# EAGLE design tinyusbboard (EAGLE 7.4.0)
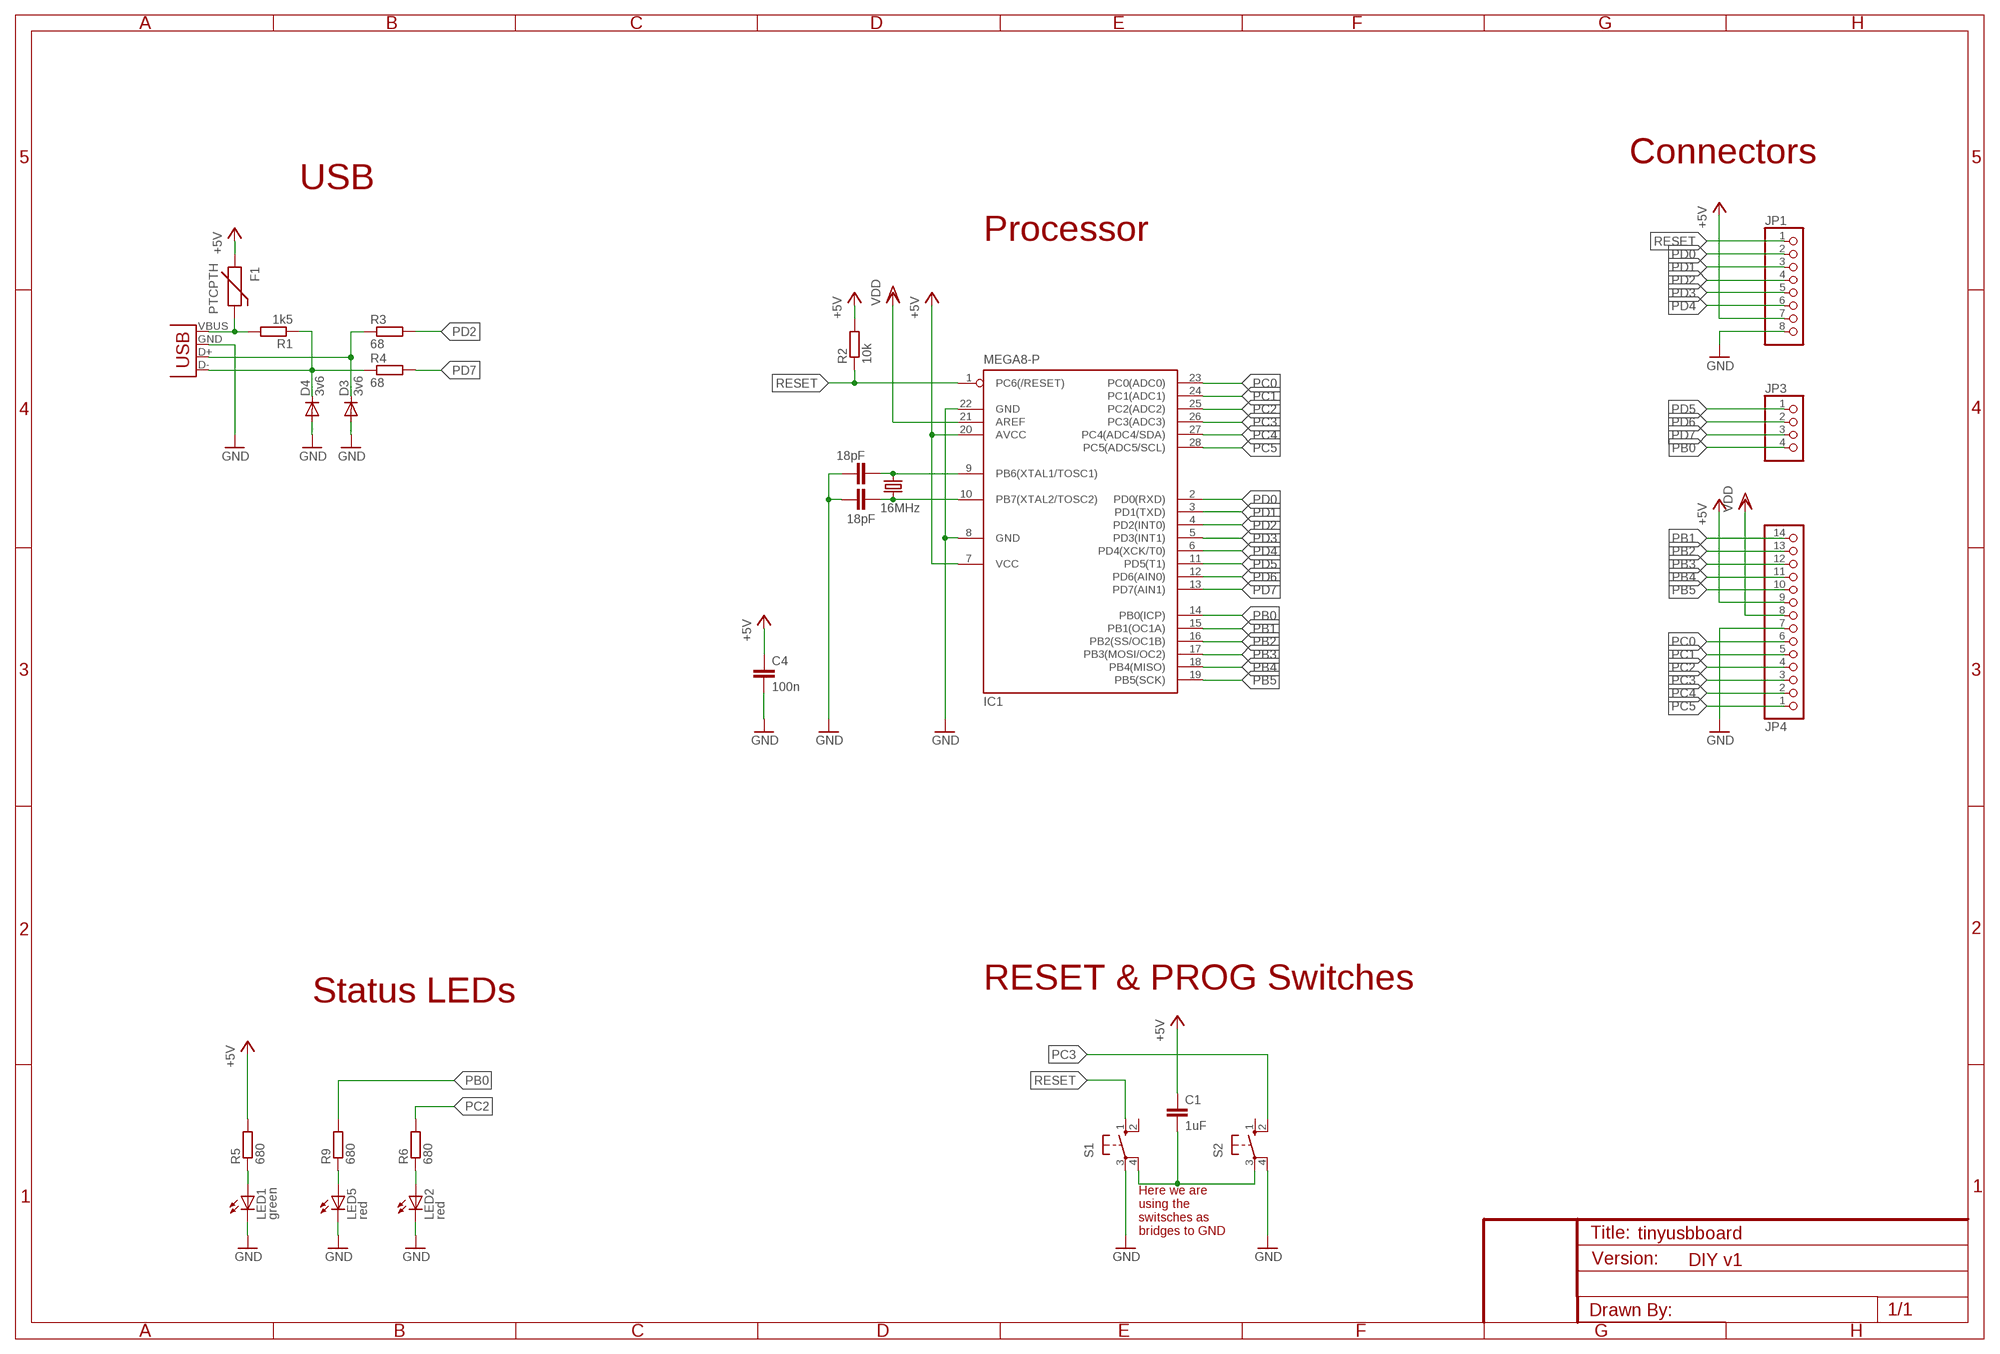
[diagram p0: schematic, sheet 1]

## Parts
C1  1uF  C-EUC0805  [C0805]
C2  18pF  C-EUC0805K  [C0805K]
C3  18pF  C-EUC0805K  [C0805K]
C4  100n  C-EUC0805  [C0805]
D3  3v6  DIODE-MINIMELF  [MINIMELF]
D4  3v6  DIODE-MINIMELF  [MINIMELF]
F1  PTCPTH  [PTC]
IC1  MEGA8-P  [DIL28-3]
JP1  PINHD-1X8  [1X08]
JP3  PINHD-1X4  [1X04]
JP4  PINHD-1X14  [1X14]
JP5  USB-A-H  [USB-A-H]
LED1  green  LEDCHIPLED_0805  [CHIPLED_0805]
LED2  red  LEDCHIPLED_0805  [CHIPLED_0805]
LED5  red  LEDCHIPLED_0805  [CHIPLED_0805]
Q1  16MHz  CRYSTALHC49S  [HC49/S]
R1  1k5  R-EU_M0805  [M0805]
R2  10k  R-EU_R1206  [R1206]
R3  68  R-EU_M0805  [M0805]
R4  68  R-EU_M0805  [M0805]
R5  680  R-EU_R0805  [R0805]
R6  680  R-EU_R0805  [R0805]
R9  680  R-EU_R0805  [R0805]
S1  10-XX  [B3F-10XX]
S2  10-XX  [B3F-10XX]

## Nets
+5V: C1.1 C4.1 F1.P$1 IC1.7(VCC) IC1.20(AVCC) JP1.7 JP4.9 R2.2 R5.2
D+: D3.C JP5.D+(D-) R3.1
D-: D4.C JP5.D-(D+) R1.1 R4.1
GND: C2.2 C3.2 C4.2 D3.A D4.A IC1.8(GND) IC1.22(GND) JP1.8 JP4.7 JP5.GND(VBUS) LED1.C LED2.C LED5.C S1.3(P) S2.4(P1)
N$1: F1.P$2 JP5.VBUS(GND) R1.2
N$4: LED1.A R5.1
N$5: C3.1 IC1.9(PB6(XTAL1/TOSC1)) Q1.1
N$6: C2.1 IC1.10(PB7(XTAL2/TOSC2)) Q1.2
N$7: LED5.A R9.1
N$8: LED2.A R6.1
N$9: C1.2 S1.4(P1) S2.3(P)
PB0: IC1.14(PB0(ICP)) JP3.4 R9.2
PB1: IC1.15(PB1(OC1A)) JP4.14
PB2: IC1.16(PB2(SS/OC1B)) JP4.13
PB3: IC1.17(PB3(MOSI/OC2)) JP4.12
PB4: IC1.18(PB4(MISO)) JP4.11
PB5: IC1.19(PB5(SCK)) JP4.10
PC0: IC1.23(PC0(ADC0)) JP4.6
PC1: IC1.24(PC1(ADC1)) JP4.5
PC2: IC1.25(PC2(ADC2)) JP4.4 R6.2
PC3: IC1.26(PC3(ADC3)) JP4.3 S2.2(S1)
PC4: IC1.27(PC4(ADC4/SDA)) JP4.2
PC5: IC1.28(PC5(ADC5/SCL)) JP4.1
PD0: IC1.2(PD0(RXD)) JP1.2
PD1: IC1.3(PD1(TXD)) JP1.3
PD2: IC1.4(PD2(INT0)) JP1.4 R3.2
PD3: IC1.5(PD3(INT1)) JP1.5
PD4: IC1.6(PD4(XCK/T0)) JP1.6
PD5: IC1.11(PD5(T1)) JP3.1
PD6: IC1.12(PD6(AIN0)) JP3.2
PD7: IC1.13(PD7(AIN1)) JP3.3 R4.2
RESET: IC1.1(PC6(/RESET)) JP1.1 R2.1 S1.1(S)
VDD: IC1.21(AREF) JP4.8
Unconnected: S1.2(S1) S2.1(S)

## Notes on the sheet
- Connectors
- USB
- Processor
- RESET & PROG Switches
- Status LEDs
- Here we are
  using the 
  switsches as
  bridges to GND
- DIY v1

## Library data of the parts
C1 C4 = rcl-2:C-EU: CAPACITOR, European symbol
C2 C3 = resistor:C-EU: CAPACITOR, European symbol
D3 D4 = diode:DIODE-: DIODE
F1 = SparkFun:PTC: Resettable Fuse PTC Resettable Fuse. Spark Fun Electronics SKU : COM-08357
IC1 = atmel:MEGA8-P: MICROCONTROLLER 8 Kbytes FLASH, 1 kbytes SRAM, 512 bytes EEPROM, USART, 4-channel 10 bit ADC, 2-channel 8 bit ADC Pin compatible with Atmega48, ATMega88, ATMega168 Source: avr.lbr; OC_FARNELL: unknown; OC_NEWARK: unknown
JP1 = pinhead:PINHD-1X8: PIN HEADER
JP3 = pinhead:PINHD-1X4: PIN HEADER
JP4 = pinhead:PINHD-1X14: PIN HEADER
JP5 = SparkFun-Connectors:USB: USB Connectors USB-B-PTH is fully proven SKU : PRT-00139/CONN-08278 USB-miniB is fully proven SKU : PRT-00587 USB-A-PCB is untested. USB-A-H is throughly reviewed, but untested. Spark Fun Electronics SKU : PRT-00437 USB-B-SMT is throughly reviewed, but untested. Needs silkscreen touching up. USB-A-S has not been used/tested USB-MB-H has not been used/tested USB-MICROB has been used. CONN-09505
LED1 LED2 LED5 = led:LED: LED OSRAM: - CHIPLED LG R971, LG N971, LY N971, LG Q971, LY Q971, LO R971, LY R971 LH N974, LH R974 LS Q976, LO Q976, LY Q976 LO Q996 - Hyper CHIPLED LW Q18S LB Q993, LB Q99A, LB R99A - SideLED LS A670, LO A670, LY A670, LG A670, LP A670 LB A673, LV A673, LT A673, LW A673 LH A674 LY A675 LS A676, LA A676, LO A676, LY A676, LW A676 LS A679, LY A679, LG A679 - Hyper Micro SIDELED® LS Y876, LA Y876, LO Y876, LY Y876 LT Y87S - SmartLED LW L88C, LW L88S LB L89C, LB L89S, LG L890 LS L89K, LO L89K, LY L89K LS L896, LA L896, LO L896, LY L896 - TOPLED LS T670, LO T670, LY T670, LG T670, LP T670 LSG T670, LSP T670, LSY T670, LOP T670, LYG T670 LG T671, LOG T671, LSG T671 LB T673, LV T673, LT T673, LW T673 LH T674 LS T676, LA T676, LO T676, LY T676, LB T676, LH T676, LSB T676, LW T676 LB T67C, LV T67C, LT T67C, LS T67K, LO T67K, LY T67K, LW E67C LS E67B, LA E67B, LO E67B, LY E67B, LB E67C, LV E67C, LT E67C LW T67C LS T679, LY T679, LG T679 LS T770, LO T770, LY T770, LG T770, LP T770 LB T773, LV T773, LT T773, LW T773 LH T774 LS E675, LA E675, LY E675, LS T675 LS T776, LA T776, LO T776, LY T776, LB T776 LHGB T686 LT T68C, LB T68C - Hyper Mini TOPLED® LB M676 - Mini TOPLED Santana® LG M470 LS M47K, LO M47K, LY M47K Source: http://www.osram.convergy.de LUXEON: - LUMILED® LXK2-PW12-R00, LXK2-PW12-S00, LXK2-PW14-U00, LXK2-PW14-V00 LXK2-PM12-R00, LXK2-PM12-S00, LXK2-PM14-U00 LXK2-PE12-Q00, LXK2-PE12-R00, LXK2-PE12-S00, LXK2-PE14-T00, LXK2-PE14-U00 LXK2-PB12-K00, LXK2-PB12-L00, LXK2-PB12-M00, LXK2-PB14-N00, LXK2-PB14-P00, LXK2-PB14-Q00 LXK2-PR12-L00, LXK2-PR12-M00, LXK2-PR14-Q00, LXK2-PR14-R00 LXK2-PD12-Q00, LXK2-PD12-R00, LXK2-PD12-S00 LXK2-PH12-R00, LXK2-PH12-S00 LXK2-PL12-P00, LXK2-PL12-Q00, LXK2-PL12-R00 Source: www.luxeon.com KINGBRIGHT: KA-3528ASYC Source: www.kingbright.com
Q1 = crystal:CRYSTAL: CRYSTAL; OC_FARNELL: 1667008; OC_NEWARK: unknown
R1-R6 R9 = rcl-2:R-EU_: RESISTOR, European symbol
S1 S2 = switch-omron:10-XX: OMRON SWITCH; MPN: B3F-1000; OC_FARNELL: 176432; OC_NEWARK: 36M3542

## Board
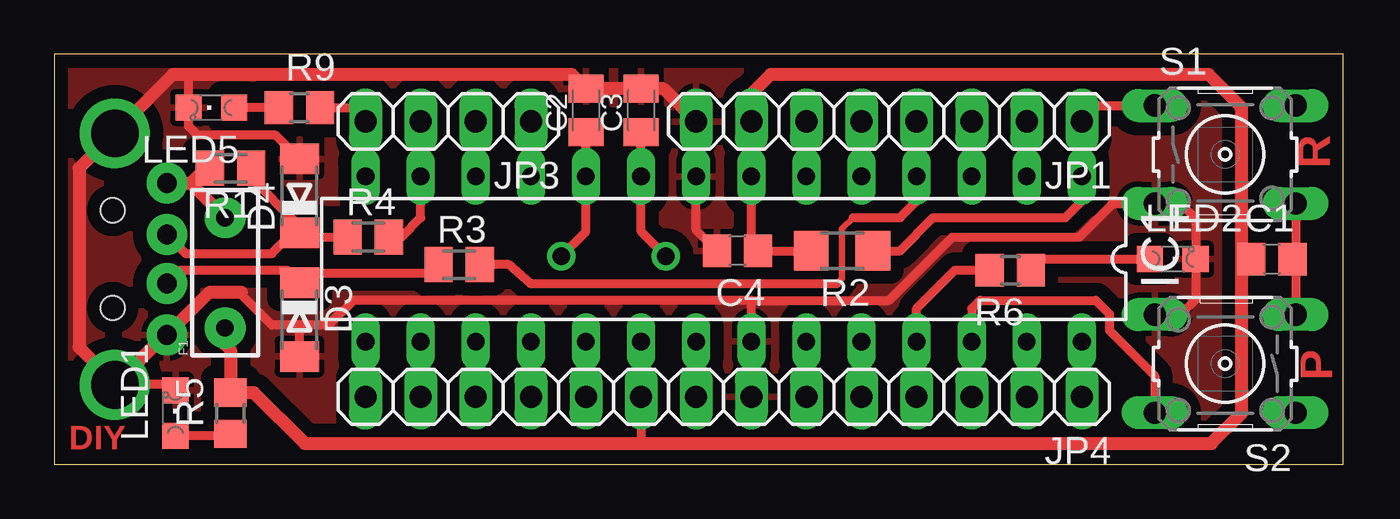
[diagram p1: board, top side]
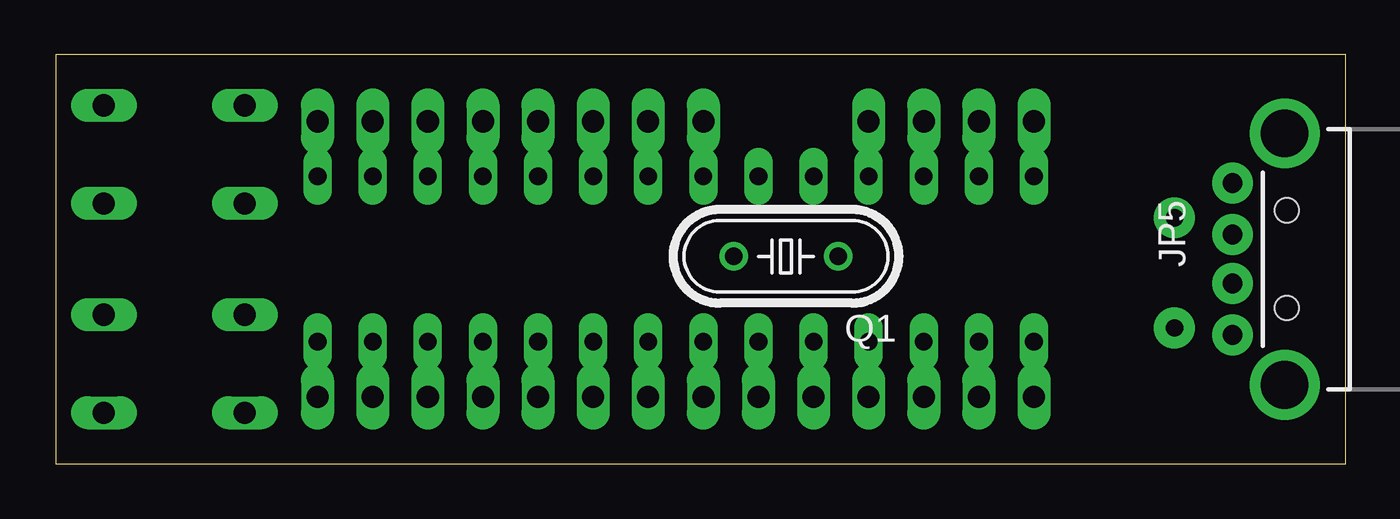
[diagram p2: board, bottom side, seen from below]

Size 59.42 x 18.92 mm. Coordinates in mm from the lower left corner, seen from the top.
Outline: 0,0 59.42,0 59.42,18.92 0,18.92 0,0
Copper layers (1*16): Top 0.035mm / dielectric 1.5mm / Bottom 0.035mm
Design rules "default *": minimum track width 12mil, minimum drill 0.8mm, track to track 12mil, track to pad 12mil, pad to pad 12mil, via to via 12mil, smd to smd 0mil, copper to edge 25mil, drill to drill 8mil, minimum pad ring 10mil, minimum via ring 8mil, stop-mask expansion 4mil, vias tented up to drill 0mil, thermal gap 10mil

### Footprints (pad centres in the part's own frame; a part is rotated, then mirrored left to right if it is on the bottom)
C0805 = smd 1.3 x 1.5: 1 -0.95,0; 2 0.95,0
C0805K = smd 1.3 x 1.6: 1 -1,0; 2 1,0
MINIMELF = smd 1.4 x 1.8: A 1.7,0; C -1.7,0
PTC = drill 0.8 pad 1.88: P$1 -2.54,0; P$2 2.54,0
DIL28-3 = drill 0.813 long: 1 -16.51,-3.81; 2 -13.97,-3.81; 3 -11.43,-3.81; 4 -8.89,-3.81; 5 -6.35,-3.81; 6 -3.81,-3.81; 7 -1.27,-3.81; 8 1.27,-3.81; 9 3.81,-3.81; 10 6.35,-3.81; 11 8.89,-3.81; 12 11.43,-3.81; 13 13.97,-3.81; 14 16.51,-3.81; 15 16.51,3.81; 16 13.97,3.81; 17 11.43,3.81; 18 8.89,3.81; 19 6.35,3.81; 20 3.81,3.81; 21 1.27,3.81; 22 -1.27,3.81; 23 -3.81,3.81; 24 -6.35,3.81; 25 -8.89,3.81; 26 -11.43,3.81; 27 -13.97,3.81; 28 -16.51,3.81
1X08 = drill 1.016 long: 1 -8.89,0; 2 -6.35,0; 3 -3.81,0; 4 -1.27,0; 5 1.27,0; 6 3.81,0; 7 6.35,0; 8 8.89,0
1X04 = drill 1.016 long: 1 -3.81,0; 2 -1.27,0; 3 1.27,0; 4 3.81,0
1X14 = drill 1.016 long: 1 -16.51,0; 2 -13.97,0; 3 -11.43,0; 4 -8.89,0; 5 -6.35,0; 6 -3.81,0; 7 -1.27,0; 8 1.27,0; 9 3.81,0; 10 6.35,0; 11 8.89,0; 12 11.43,0; 13 13.97,0; 14 16.51,0
USB-A-H = drill 0.914 pad 1.88: D+ 2.4,1.127; D- 2.4,-1.127; GND 2.4,3.5; VBUS 2.4,-3.5 | drill 2.2: GND2 0,-5.8; GND3 0,5.8 | hole 1.1: -0.1,2.25; -0.1,-2.25
CHIPLED_0805 = smd 1.2 x 1.2: A 0,-1.05; C 0,1.05
HC49/S = drill 0.813: 1 2.413,0; 2 -2.413,0
M0805 = smd 1.3 x 1.6: 1 -0.95,0; 2 0.95,0
R1206 = smd 1.6 x 1.803: 1 -1.422,0; 2 1.422,0
R0805 = smd 1.3 x 1.5: 1 -0.95,0; 2 0.95,0
B3F-10XX = drill 1.016 long: 1 -3.251,2.261; 2 3.251,2.261; 3 -3.251,-2.261; 4 3.251,-2.261

### Placement (x,y rotation side)
C1  56.13,9.47 0 top
C2  24.51,16.33 90 top
C3  27.05,16.33 90 top
C4  31.5,9.86 180 top
D3  11.3,6.68 270 top
D4  11.3,12.4 90 top
F1  7.87,8.84 90 top
IC1  30.86,9.47 180 top
JP1  38.48,15.82 180 top
JP3  18.16,15.82 180 top
JP4  30.86,3.12 180 top
JP5  2.79,9.47 180 bottom
LED1  5.59,2.36 0 top
LED2  51.56,9.47 270 top
LED5  7.24,16.46 90 top
Q1  25.78,9.6 180 bottom
R1  8.13,13.67 180 top
R2  36.32,9.86 180 top
R3  18.67,9.22 0 top
R4  14.48,10.49 0 top
R5  8.13,2.36 90 top
R6  44.07,8.97 180 top
R9  11.3,16.46 0 top
S1  53.98,14.3 0 top
S2  53.98,4.65 180 top

### Tracks (layer width: path | path; a pad name or v marks a point on that pad's centre or on a via)
+5V
  Top 0.406: IC1.20 JP4.9 27.05,0.97 | IC1.7 32.13,10.17 C4.1 R2.2 | C1.1 54.74,9.47
  Top 0.61: IC1.7 JP1.7 32.13,17.09 33.02,17.98 53.21,17.98 54.74,16.46 54.74,9.47 54.74,2.36 53.34,0.97 27.05,0.97 11.56,0.97 9.21,3.31 R5.2 8.13,5.28 7.87,5.54 F1.P$1
D+
  Top 0.406: JP5.D+ 5.81,8.97 10.72,8.97 D3.C 11.76,8.84 17.27,8.84 17.65,9.22 R3.1
D-
  Top 0.406: JP5.D- 6.07,9.73 10.03,9.73 11,10.7 | 11,10.7 D4.C 11.48,10.49 R4.1 | 11,10.7 11,11.3 9.21,13.1 R1.1
GND
  Top 0.406: JP1.8 IC1.8 29.59,10.81 C4.2 | JP4.7 IC1.22 32.13,7.57 | 32.13,7.57 13.79,7.57 12.65,6.43 11.3,6.43 | 32.13,7.57 38.48,7.57 41.4,10.49 47.24,10.49 48.79,12.04 S1.3 51.92,12.04 52.61,11.35 LED2.C 52.61,7.6 51.92,6.91 S2.4 | D4.A 10.21,15.19 6.6,15.19 6.19,15.6 LED5.C 6.19,17.76 6.22,17.98 | 11.3,6.43 10.03,6.43 8.64,7.82 8.64,7.95 | D3.A 11.3,6.43 | LED1.C 5.3,3.7 2.86,3.7
  Top 0.61: JP1.8 28.08,17.33 C3.2 C2.2 23.86,17.98 6.22,17.98 5.46,17.98 1.14,13.67 1.14,5.41 2.86,3.7 | 8.64,7.95 7.17,7.95 JP5.GND 5.19,5.93 5.21,5.92 5.08,5.92 2.86,3.7 | 2.79,3.63 2.86,3.7
  pour Top (isolate 0.61): 0.51,18.49 0.51,0.58 59.05,0.58 59.05,18.49
N$1
  Top 0.61: JP5.VBUS 6.28,12.97 | 6.28,12.97 F1.P$2 | R1.2 6.97,13.67 6.28,12.97
N$4
  Top 0.406: R5.1 8.03,1.31 LED1.A
N$5
  Top 0.406: Q1.1 27.05,10.74 IC1.9 C3.1
N$6
  Top 0.406: Q1.2 24.51,10.74 IC1.10 C2.1
N$7
  Top 0.406: R9.1 LED5.A
N$8
  Top 0.406: R6.1 45.53,9.47 LED2.A
N$9
  Top 0.406: S1.4 57.23,9.6 | 57.23,9.6 S2.3 | C1.2 57.21,9.6 57.23,9.6
PB0
  Top 0.406: IC1.14 JP3.4 13.72,16.46 R9.2
PB1
  Top 0.406: IC1.15 JP4.14
PB2
  Top 0.406: IC1.16 JP4.13
PB3
  Top 0.406: IC1.17 JP4.12
PB4
  Top 0.406: IC1.18 JP4.11
PB5
  Top 0.406: IC1.19 JP4.10
PC0
  Top 0.406: IC1.23 JP4.6
PC1
  Top 0.406: IC1.24 JP4.5
PC2
  Top 0.406: JP4.4 IC1.25 39.75,7.19 41.53,8.97 R6.2
PC3
  Top 0.406: JP4.3 IC1.26 42.29,7.19 42.67,7.57 48.01,7.57 48.64,6.93 48.64,6.17 50.72,4.09 S2.2
PC4
  Top 0.406: IC1.27 JP4.2
PC5
  Top 0.406: IC1.28 JP4.1
PD0
  Top 0.406: IC1.2 JP1.2
PD1
  Top 0.406: IC1.3 JP1.3
PD2
  Top 0.305: 36.07,8.33 36.32,8.59 36.32,10.87 36.83,11.38
  Top 0.406: JP1.4 IC1.4 39.75,12.14 38.99,11.38 36.83,11.38 | 36.07,8.33 21.97,8.33 20.96,9.22 R3.2
PD3
  Top 0.406: IC1.5 JP1.5
PD4
  Top 0.406: IC1.6 JP1.6
PD5
  Top 0.406: JP3.1 IC1.11
PD6
  Top 0.406: IC1.12 JP3.2
PD7
  Top 0.406: JP3.3 IC1.13 16.89,11.38 16,10.49 R4.2
RESET
  Top 0.406: S1.1 48.11,16.56 JP1.1 IC1.1 47.37,12.14 46.61,11.38 40.51,11.38 38.99,9.86 R2.1
VDD
  Top 0.406: IC1.21 JP4.8
(copper drawn outside any net)
  shapes: Top circle x2

### Text on the board
Top: R | P | DIY